# EAGLE design ServoShield (EAGLE 5.11)
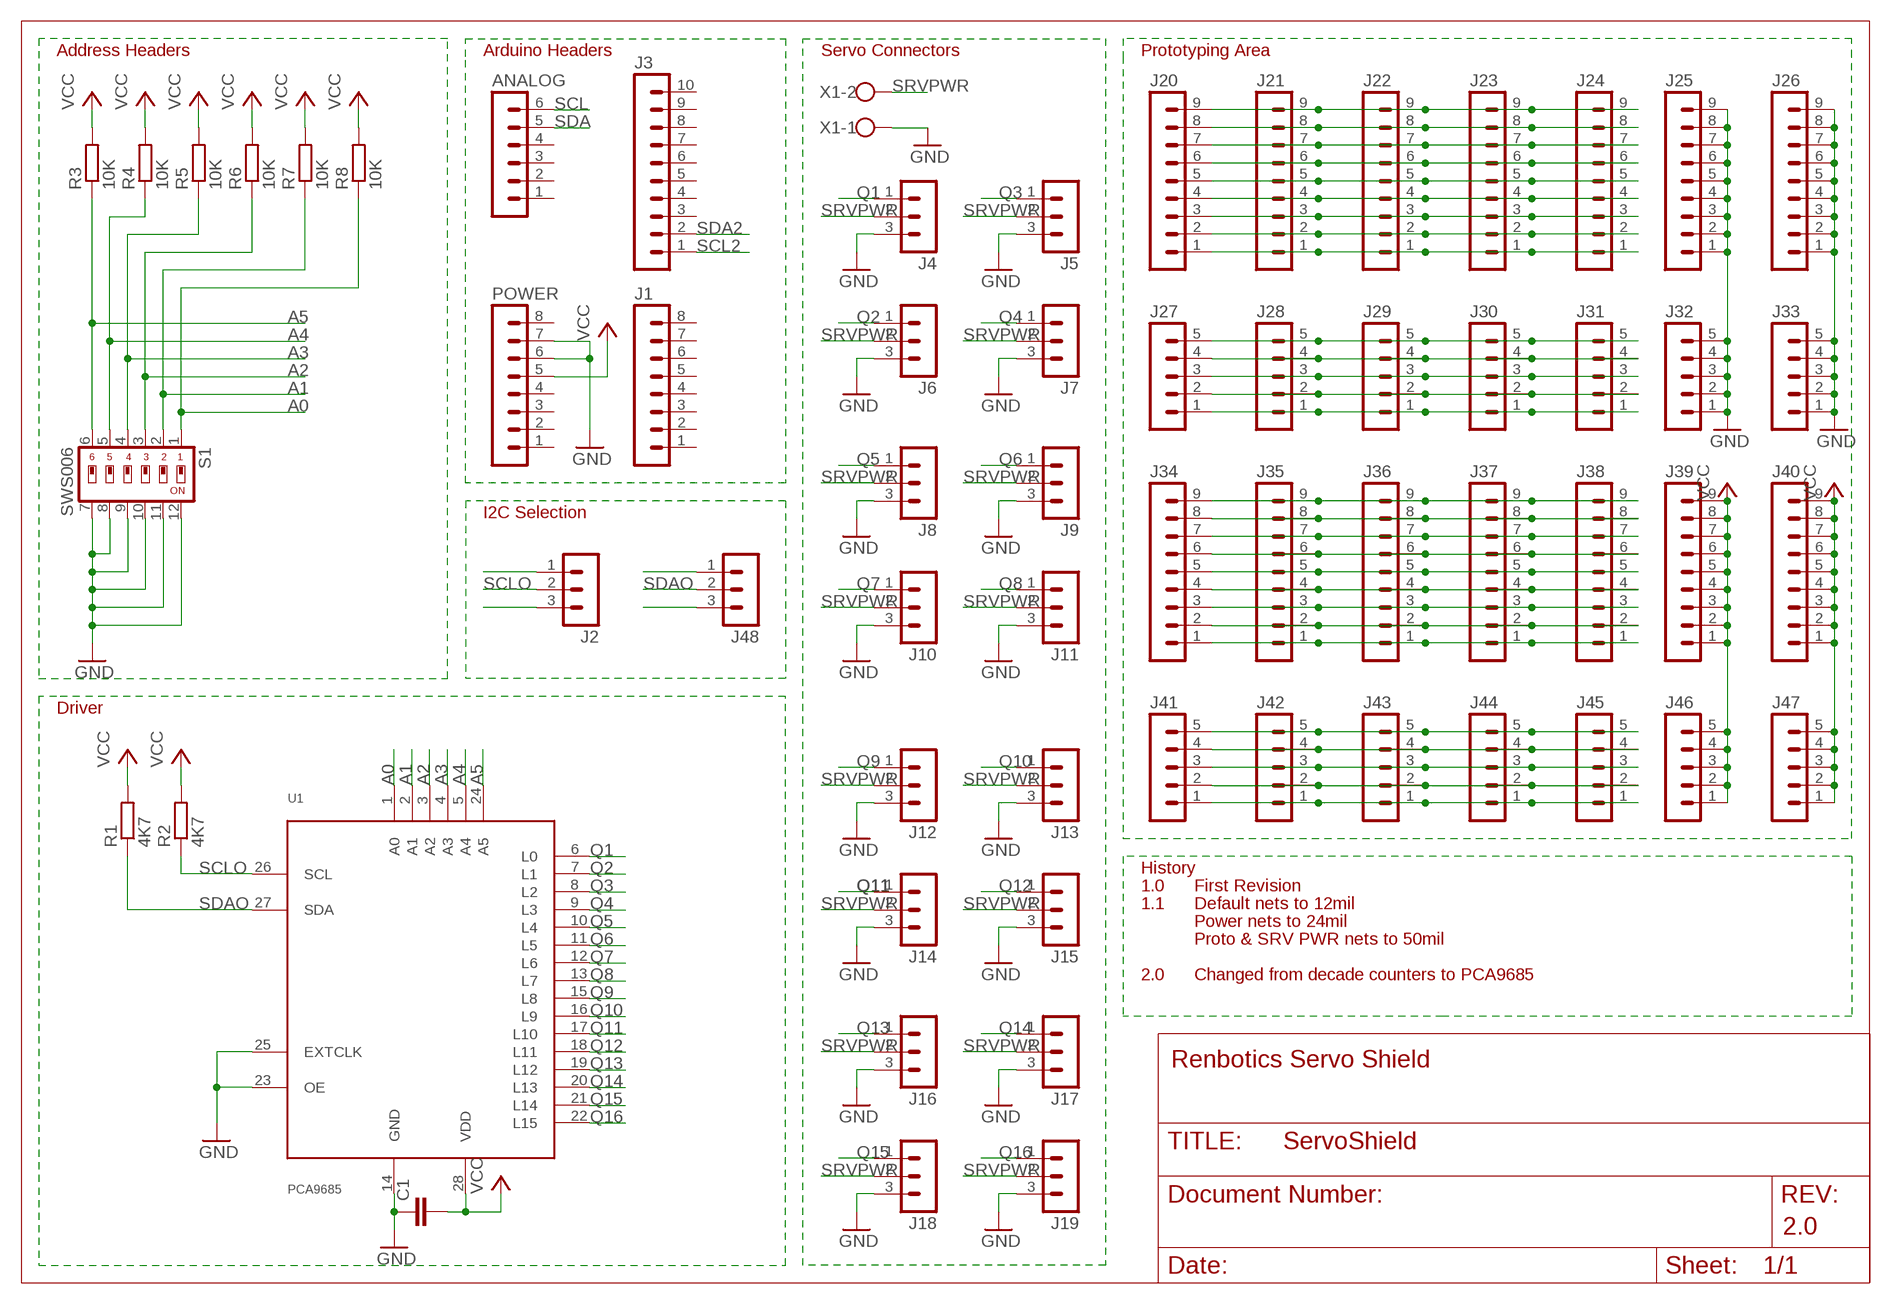
[diagram p0: schematic, sheet 1]

## Parts
ANALOG  MA06-1  [MA06-1]
C1  C-EUC0805  [C0805]
J1  MA08-1  [MA08-1]
J2  MA03-1  [MA03-1]
J3  MA10-1  [MA10-1]
J4  MA03-1  [MA03-1]
J5  MA03-1  [MA03-1]
J6  MA03-1  [MA03-1]
J7  MA03-1  [MA03-1]
J8  MA03-1  [MA03-1]
J9  MA03-1  [MA03-1]
J10  MA03-1  [MA03-1]
J11  MA03-1  [MA03-1]
J12  MA03-1  [MA03-1]
J13  MA03-1  [MA03-1]
J14  MA03-1  [MA03-1]
J15  MA03-1  [MA03-1]
J16  MA03-1  [MA03-1]
J17  MA03-1  [MA03-1]
J18  MA03-1  [MA03-1]
J19  MA03-1  [MA03-1]
J20  MA09-1  [MA09-1]
J21  MA09-1  [MA09-1]
J22  MA09-1  [MA09-1]
J23  MA09-1  [MA09-1]
J24  MA09-1  [MA09-1]
J25  MA09-1  [MA09-1]
J26  MA09-1  [MA09-1]
J27  MA05-1  [MA05-1]
J28  MA05-1  [MA05-1]
J29  MA05-1  [MA05-1]
J30  MA05-1  [MA05-1]
J31  MA05-1  [MA05-1]
J32  MA05-1  [MA05-1]
J33  MA05-1  [MA05-1]
J34  MA09-1  [MA09-1]
J35  MA09-1  [MA09-1]
J36  MA09-1  [MA09-1]
J37  MA09-1  [MA09-1]
J38  MA09-1  [MA09-1]
J39  MA09-1  [MA09-1]
J40  MA09-1  [MA09-1]
J41  MA05-1  [MA05-1]
J42  MA05-1  [MA05-1]
J43  MA05-1  [MA05-1]
J44  MA05-1  [MA05-1]
J45  MA05-1  [MA05-1]
J46  MA05-1  [MA05-1]
J47  MA05-1  [MA05-1]
J48  MA03-1  [MA03-1]
POWER  MA08-1  [MA08-1]
R1  4K7  R-EU_R0805  [R0805]
R2  4K7  R-EU_R0805  [R0805]
R3  10K  R-EU_R0805  [R0805]
R4  10K  R-EU_R0805  [R0805]
R5  10K  R-EU_R0805  [R0805]
R6  10K  R-EU_R0805  [R0805]
R7  10K  R-EU_R0805  [R0805]
R8  10K  R-EU_R0805  [R0805]
S1  SWS006  [SMS-006]
U1  PCA9685  [TSSOP28]
X1  W237-102  [W237-102]

## Nets
A0: R8.1 S1.1 U1.1(A0)
A1: R7.1 S1.2 U1.2(A1)
A2: R6.1 S1.3 U1.3(A2)
A3: R5.1 S1.4 U1.4(A3)
A4: R4.1 S1.5 U1.5(A4)
A5: R3.1 S1.6 U1.24(A5)
GND: C1.1 J4.3 J5.3 J6.3 J7.3 J8.3 J9.3 J10.3 J11.3 J12.3 J13.3 J14.3 J15.3 J16.3 J17.3 J18.3 J19.3 J25.1 J25.2 J25.3 J25.4 J25.5 J25.6 J25.7 J25.8 J25.9 J26.1 J26.2 J26.3 J26.4 J26.5 J26.6 J26.7 J26.8 J26.9 J32.1 J32.2 J32.3 J32.4 J32.5 J33.1 J33.2 J33.3 J33.4 J33.5 POWER.6 POWER.7 S1.7 S1.8 S1.9 S1.10 S1.11 S1.12 U1.14(GND) U1.23(OE) U1.25(EXTCLK) X1.1
N$1: J20.1 J21.1 J22.1 J23.1 J24.1
N$2: J20.2 J21.2 J22.2 J23.2 J24.2
N$3: J20.3 J21.3 J22.3 J23.3 J24.3
N$4: J20.4 J21.4 J22.4 J23.4 J24.4
N$5: J20.5 J21.5 J22.5 J23.5 J24.5
N$6: J20.6 J21.6 J22.6 J23.6 J24.6
N$7: J20.7 J21.7 J22.7 J23.7 J24.7
N$8: J20.8 J21.8 J22.8 J23.8 J24.8
N$9: J20.9 J21.9 J22.9 J23.9 J24.9
N$10: J27.5 J28.5 J29.5 J30.5 J31.5
N$11: J27.4 J28.4 J29.4 J30.4 J31.4
N$12: J27.3 J28.3 J29.3 J30.3 J31.3
N$13: J27.2 J28.2 J29.2 J30.2 J31.2
N$14: J27.1 J28.1 J29.1 J30.1 J31.1
N$19: J34.9 J35.9 J36.9 J37.9 J38.9
N$20: J34.8 J35.8 J36.8 J37.8 J38.8
N$21: J34.7 J35.7 J36.7 J37.7 J38.7
N$22: J34.6 J35.6 J36.6 J37.6 J38.6
N$23: J34.5 J35.5 J36.5 J37.5 J38.5
N$24: J34.4 J35.4 J36.4 J37.4 J38.4
N$25: J34.3 J35.3 J36.3 J37.3 J38.3
N$26: J34.2 J35.2 J36.2 J37.2 J38.2
N$27: J34.1 J35.1 J36.1 J37.1 J38.1
N$28: J41.5 J42.5 J43.5 J44.5 J45.5
N$29: J41.4 J42.4 J43.4 J44.4 J45.4
N$30: J41.3 J42.3 J43.3 J44.3 J45.3
N$31: J41.2 J42.2 J43.2 J44.2 J45.2
N$32: J41.1 J42.1 J43.1 J44.1 J45.1
Q1: J4.1 U1.6(L0)
Q2: J6.1 U1.7(L1)
Q3: J5.1 U1.8(L2)
Q4: J7.1 U1.9(L3)
Q5: J8.1 U1.10(L4)
Q6: J9.1 U1.11(L5)
Q7: J10.1 U1.12(L6)
Q8: J11.1 U1.13(L7)
Q9: J12.1 U1.15(L8)
Q10: J13.1 U1.16(L9)
Q11: J14.1 U1.17(L10)
Q12: J15.1 U1.18(L11)
Q13: J16.1 U1.19(L12)
Q14: J17.1 U1.20(L13)
Q15: J18.1 U1.21(L14)
Q16: J19.1 U1.22(L15)
SCL: ANALOG.6 J2.3
SCL2: J2.1 J3.1
SCLO: J2.2 R2.1 U1.26(SCL)
SDA: ANALOG.5 J48.3
SDA2: J3.2 J48.1
SDAO: J48.2 R1.1 U1.27(SDA)
SRVPWR: J4.2 J5.2 J6.2 J7.2 J8.2 J9.2 J10.2 J11.2 J12.2 J13.2 J14.2 J15.2 J16.2 J17.2 J18.2 J19.2 X1.2
VCC: C1.2 J39.1 J39.2 J39.3 J39.4 J39.5 J39.6 J39.7 J39.8 J39.9 J40.1 J40.2 J40.3 J40.4 J40.5 J40.6 J40.7 J40.8 J40.9 J46.1 J46.2 J46.3 J46.4 J46.5 J47.1 J47.2 J47.3 J47.4 J47.5 POWER.5 R1.2 R2.2 R3.2 R4.2 R5.2 R6.2 R7.2 R8.2 U1.28(VDD)
Unconnected: ANALOG.1 ANALOG.2 ANALOG.3 ANALOG.4 J1.1 J1.2 J1.3 J1.4 J1.5 J1.6 J1.7 J1.8 J3.3 J3.4 J3.5 J3.6 J3.7 J3.8 J3.9 J3.10 POWER.1 POWER.2 POWER.3 POWER.4 POWER.8

## Notes on the sheet
- Address Headers | Arduino Headers | Servo Connectors | Prototyping Area
- I2C Selection
- Driver
- History
- 1.0 | First Revision
- 1.1 | Default nets to 12mil
- Power nets to 24mil
- Proto & SRV PWR nets to 50mil
- 2.0 | Changed from decade counters to PCA9685
- Renbotics Servo Shield
- 2.0

## Library data of the parts
ANALOG = con-lstb:MA06-1: PIN HEADER
C1 = resistor:C-EU: CAPACITOR, European symbol
J1 POWER = con-lstbupdate:MA08-1: PIN HEADER; OC_FARNELL: unknown; OC_NEWARK: unknown
J2 J4-J19 J48 = con-lstb:MA03-1: PIN HEADER
J3 = con-lstbupdate:MA10-1: PIN HEADER; OC_FARNELL: unknown; OC_NEWARK: unknown
J20-J26 J34-J40 = con-lstb:MA09-1: PIN HEADER
J27-J33 J41-J47 = con-lstb:MA05-1: PIN HEADER
R1-R8 = resistor:R-EU_: RESISTOR, European symbol
S1 = smd-special:SWS006: SMD Dip Switch 6 pol.
U1 = wsmith:PCA9685
X1 = con-wago-500:W237-102: WAGO SCREW CLAMP

## Net classes
0 default: width 0.254 mm, drill 0.305 mm, clearance 0.152 mm
1 power: width 0.61 mm, drill 0.508 mm, clearance 0.152 mm

## Board
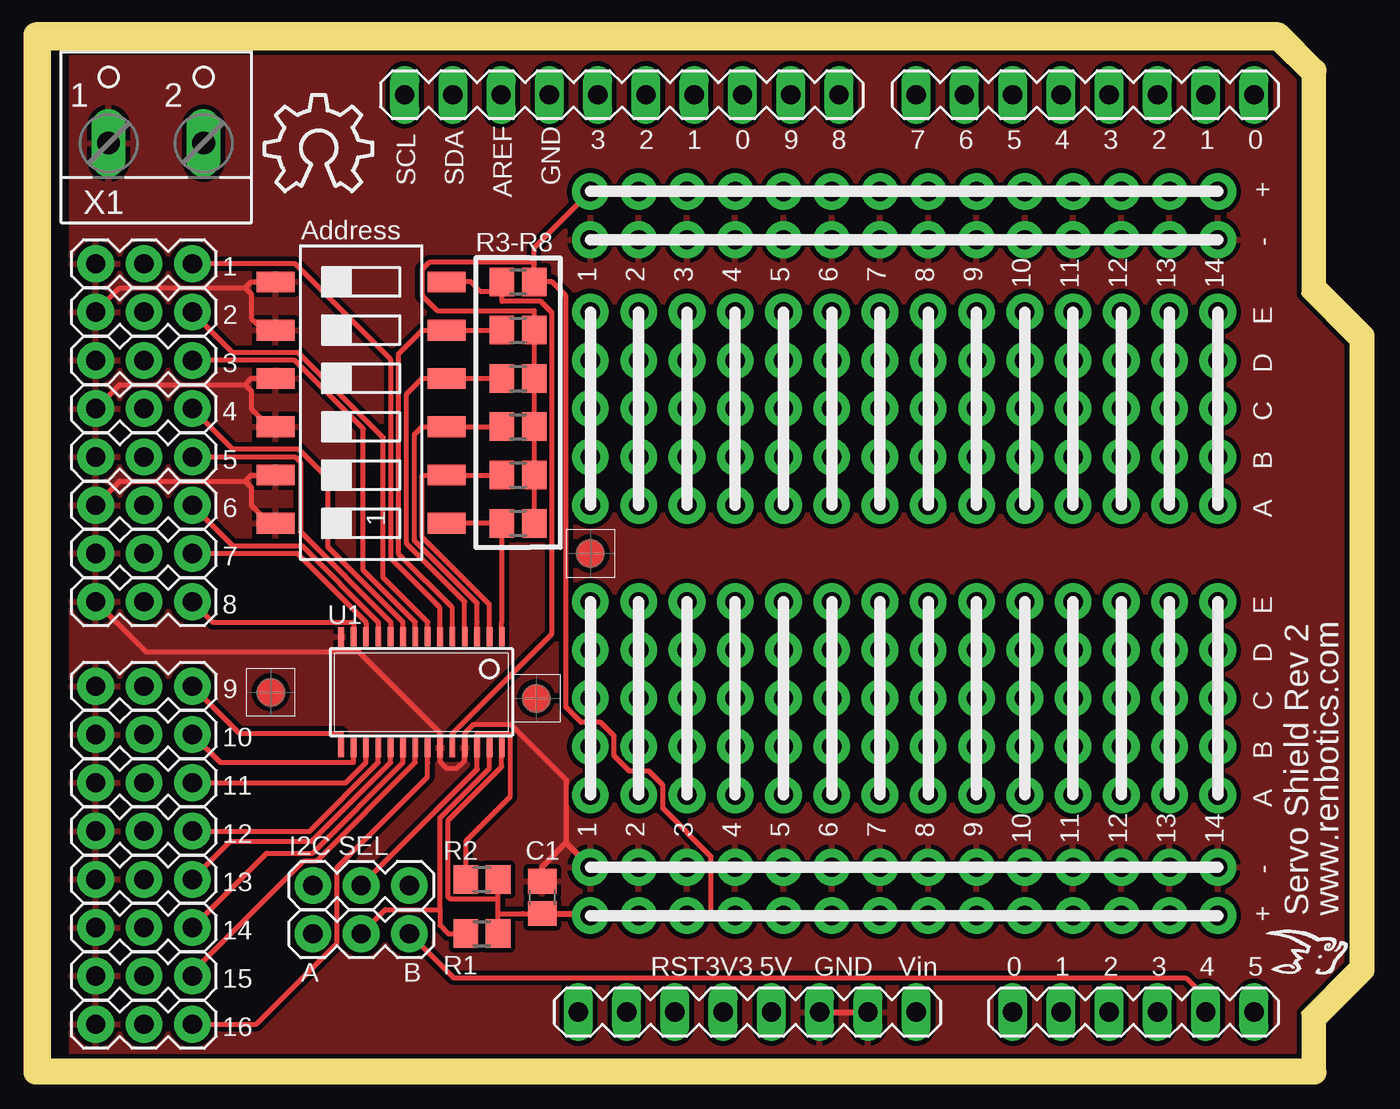
[diagram p1: board, top side]
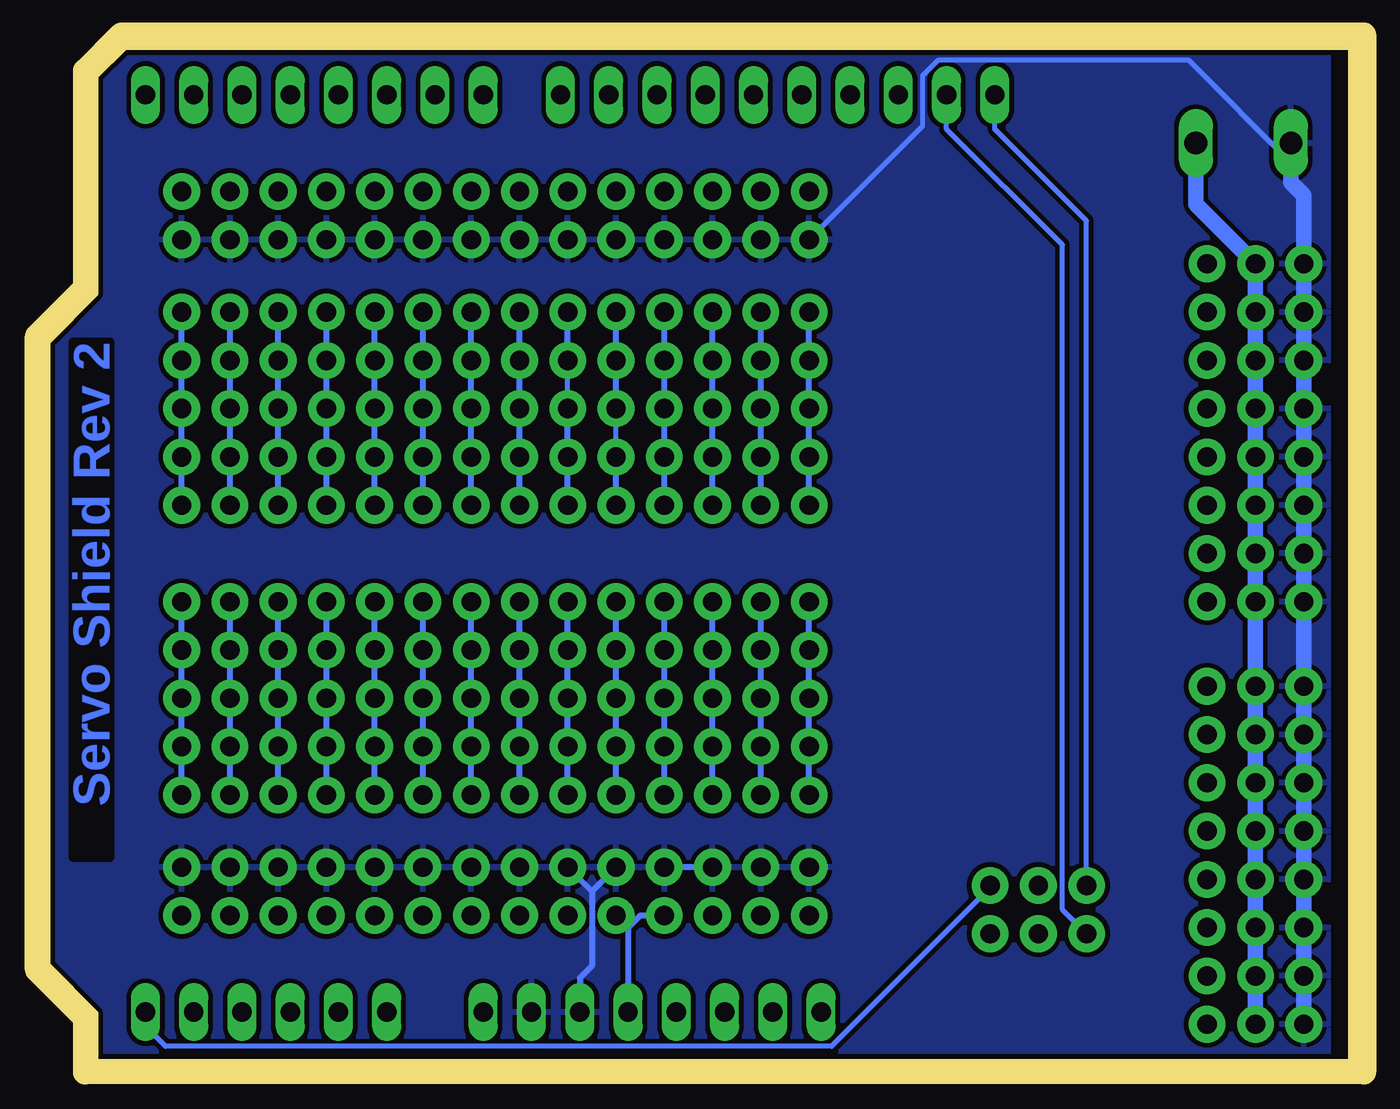
[diagram p2: board, bottom side, seen from below]

Size 68.66 x 53.34 mm. Coordinates in mm from the lower left corner, seen from the top.
Outline: 0,47.03 0,0.05
Outline: 0.08,53.34 64.59,53.34 66.12,51.82 66.12,40.39 68.66,37.85 68.66,5.08 66.12,2.54 66.12,0 0.08,0 0.08,53.34
Copper layers (1*16): Top 0.035mm / dielectric 1.5mm / Bottom 0.035mm
Design rules "Fusion_eagle_rule_v1.1": minimum track width 6mil, minimum drill 12mil, track to track 6mil, track to pad 6mil, pad to pad 6mil, via to via 6mil, smd to smd 0mil, copper to edge 10mil, drill to drill 10mil, minimum pad ring 10mil, minimum via ring 6mil, stop-mask expansion 2mil, vias tented up to drill 100mil, thermal gap 10mil
Milling: 9 lines

### Footprints (pad centres in the part's own frame; a part is rotated, then mirrored left to right if it is on the bottom)
MA06-1 = drill 1.016 long: 1 -6.35,0; 2 -3.81,0; 3 -1.27,0; 4 1.27,0; 5 3.81,0; 6 6.35,0
C0805 = smd 1.3 x 1.5: 1 -0.85,0; 2 0.85,0
MA08-1 = drill 1.016 long: 1 -8.89,0; 2 -6.35,0; 3 -3.81,0; 4 -1.27,0; 5 1.27,0; 6 3.81,0; 7 6.35,0; 8 8.89,0
MA03-1 = drill 1.016 pad 1.93 round: 1 -2.54,0; 2 0,0; 3 2.54,0
MA10-1 = drill 1.016 long: 1 -11.43,0; 2 -8.89,0; 3 -6.35,0; 4 -3.81,0; 5 -1.27,0; 6 1.27,0; 7 3.81,0; 8 6.35,0; 9 8.89,0; 10 11.43,0
MA09-1 = drill 1.016 pad 1.93 round: 1 -10.16,0; 2 -7.62,0; 3 -5.08,0; 4 -2.54,0; 5 0,0; 6 2.54,0; 7 5.08,0; 8 7.62,0; 9 10.16,0
MA05-1 = drill 1.016 pad 1.93 round: 1 -5.08,0; 2 -2.54,0; 3 0,0; 4 2.54,0; 5 5.08,0
R0805 = smd 1.3 x 1.5: 1 -0.85,0; 2 0.85,0
SMS-006 = smd 1.092 x 2.007: 1 -6.35,-4.496; 2 -3.81,-4.496; 3 -1.27,-4.496; 4 1.27,-4.496; 5 3.81,-4.496; 6 6.35,-4.496; 7 6.35,4.496; 8 3.81,4.496; 9 1.27,4.496; 10 -1.27,4.496; 11 -3.81,4.496; 12 -6.35,4.496
TSSOP28 = smd 0.305 x 0.991: 1 -4.225,-2.918; 2 -3.575,-2.918; 3 -2.925,-2.918; 4 -2.275,-2.918; 5 -1.625,-2.918; 6 -0.975,-2.918; 7 -0.325,-2.918; 8 0.325,-2.918; 9 0.975,-2.918; 10 1.625,-2.918; 11 2.275,-2.918; 12 2.925,-2.918; 13 3.575,-2.918; 14 4.225,-2.918; 15 4.225,2.918; 16 3.575,2.918; 17 2.925,2.918; 18 2.275,2.918; 19 1.625,2.918; 20 0.975,2.918; 21 0.325,2.918; 22 -0.325,2.918; 23 -0.975,2.918; 24 -1.625,2.918; 25 -2.275,2.918; 26 -2.925,2.918; 27 -3.575,2.918; 28 -4.225,2.918
W237-102 = drill 1.194 long: 1 -2.5,-1.27; 2 2.5,-1.27

### Placement (x,y rotation side)
ANALOG  57.15,2.59 0 top
C1  26.04,8.62 270 top
J1  54.61,50.85 0 top
J2  16.51,9.26 0 top
J3  30.23,50.85 0 top
J4  5.08,41.96 180 top
J5  5.08,36.88 180 top
J6  5.08,39.42 180 top
J7  5.08,34.34 180 top
J8  5.08,31.8 180 top
J9  5.08,29.26 180 top
J10  5.08,26.72 180 top
J11  5.08,24.18 180 top
J12  5.08,19.74 180 top
J13  5.08,17.2 180 top
J14  5.08,14.66 180 top
J15  5.08,12.12 180 top
J16  5.08,9.58 180 top
J17  5.08,7.04 180 top
J18  5.08,4.5 180 top
J19  5.08,1.96 180 top
J20  51.44,39.42 0 top
J21  51.44,36.88 0 top
J22  51.44,34.34 0 top
J23  51.44,31.8 0 top
J24  51.44,29.26 0 top
J25  51.44,43.23 0 top
J26  51.44,10.21 0 top
J27  33.66,39.42 0 top
J28  33.66,36.88 0 top
J29  33.66,34.34 0 top
J30  33.66,31.8 0 top
J31  33.66,29.26 0 top
J32  33.66,43.23 0 top
J33  33.66,10.21 0 top
J34  51.44,24.18 0 top
J35  51.44,21.64 0 top
J36  51.44,19.1 0 top
J37  51.44,16.56 0 top
J38  51.44,14.02 0 top
J39  51.44,45.77 0 top
J40  51.44,7.67 0 top
J41  33.66,21.64 0 top
J42  33.66,24.18 0 top
J43  33.66,19.1 0 top
J44  33.66,16.56 0 top
J45  33.66,14.02 0 top
J46  33.66,45.77 0 top
J47  33.66,7.67 0 top
J48  16.51,6.72 0 top
POWER  36.83,2.59 0 top
R1  22.86,6.72 0 top
R2  22.86,9.58 0 top
R3  24.77,41.01 0 top
R4  24.77,38.47 0 top
R5  24.77,35.93 0 top
R6  24.77,33.39 0 top
R7  24.77,30.85 0 top
R8  24.77,28.31 0 top
S1  16.51,34.66 90 top
U1  19.68,19.42 180 top
U$1  [OSHW_8X200_NOTEXT]  11.43,45.77 0 top
U$2  [FIDUCIAL_G15S]  11.75,19.42 0 top
U$3  [FIDUCIAL_G15S]  28.57,26.72 0 top
U$4  [FIDUCIAL_G15S]  25.72,19.1 0 top
X1  5.71,49.58 0 top

### Tracks (layer width: path | path; a pad name or v marks a point on that pad's centre or on a via)
A0
  Top 0.254: S1.1 R8.1 23.91,23.12 23.91,23.11 U1.1
A1
  Top 0.254: U1.2 23.26,23.11 23.26,24.03 19.72,27.57 19.72,30.85 S1.2 R7.1
A2
  Top 0.254: 22.61,23.11 | 22.61,23.11 22.61,24.11 19.32,27.4 19.32,32.98 19.72,33.39 S1.3 R6.1 | U1.3 22.61,23.11
A3
  Top 0.254: U1.4 21.96,24.18 18.91,27.23 18.91,35.12 19.72,35.93 S1.4 R5.1
A4
  Top 0.254: U1.5 21.31,23.86 18.48,26.69 18.48,37.23 19.72,38.47 S1.5 R4.1
A5
  Top 0.254: S1.6 22.29,41.01 22.8,40.49 23.91,40.49 | 23.91,40.49 23.91,39.98 25.95,39.98 26.55,39.39 26.55,22.51 21.31,17.28 U1.24 | 23.91,40.49 R3.1
GND
  Top 0.254: 10.41,40.69 10.73,41.01 S1.7 | 10.41,40.69 3.81,40.69 J6.3 | S1.8 11.37,38.47 10.73,39.11 10.73,40.37 10.41,40.69 | 10.41,35.61 10.73,35.93 S1.9 | 10.41,35.61 3.81,35.61 J7.3 | S1.10 11.68,33.39 10.73,34.33 10.73,35.29 10.41,35.61 | 15.46,21.56 16.37,21.56 20.66,17.28 U1.23 20.66,15.76 21.02,15.41 21.54,15.41 21.96,15.83 U1.25 21.96,17.28 22.42,17.73 24.37,17.73 27.29,14.81 27.29,11.49 | 15.46,21.56 5.16,21.56 4.76,21.96 J11.3 | 10.41,30.53 3.81,30.53 J9.3 | 15.46,21.56 U1.14 | 10.41,30.53 10.73,30.85 S1.11 | S1.12 11.68,28.31 10.73,29.25 10.73,30.21 10.41,30.53
  Top 0.305: POWER.6 POWER.7 | C1.1 26.04,10.24 26.2,10.4 27.29,11.49 J33.1 J33.2 J33.3 | J33.4 J33.5 | J32.1 J32.2 J32.3 J32.4 J32.5 J25.1 J25.2 J25.3 J25.4 J25.5 J25.6 J25.7 J25.8 J25.9 | J26.9 J26.8 J26.7 J26.6 J26.5 J26.4 J26.3 J26.2 J26.1
  Bottom 0.254: 3.21,47.28 8.6,52.66 21.8,52.66 22.61,51.86 22.61,49.2 J32.1
  Bottom 0.305: 40.01,8.94 40.01,5.03 40.64,4.39 POWER.6 | 40.01,8.94 J26.1 | J33.5 40.01,8.94 | J33.3 J33.4
  Bottom 0.813: X1.1 3.21,47.28 3.21,46.24 2.54,45.57 J4.3 J6.3 J5.3 J7.3 J8.3 J9.3 J10.3 J11.3 J12.3 J13.3 J14.3 J15.3 J16.3 J17.3 J18.3 J19.3
  pour Bottom (isolate 0.254): 1.27,53.71 1.27,-0.27 69.22,0.37 69.22,52.44 69.22,53.07 69.22,53.71
  pour Top (isolate 0.254): 1.27,53.71 1.27,-0.27 69.22,0.37 69.22,53.71
N$1
  Bottom 0.254: J22.1 J21.1
  Bottom 0.305: J24.1 J23.1 J22.1 | J21.1 J20.1
N$2
  Bottom 0.305: J24.2 J23.2 J22.2 J21.2 J20.2
N$3
  Bottom 0.305: J24.3 J23.3 J22.3 J21.3 J20.3
N$4
  Bottom 0.305: J24.4 J23.4 J22.4 J21.4 J20.4
N$5
  Bottom 0.305: J24.5 J23.5 J22.5 J21.5 J20.5
N$6
  Bottom 0.305: J24.6 J23.6 J22.6 J21.6 J20.6
N$7
  Bottom 0.305: J24.7 J23.7 J22.7 J21.7 J20.7
N$8
  Bottom 0.305: J24.8 J23.8 J22.8 J21.8 J20.8
N$9
  Bottom 0.305: J24.9 J23.9 J22.9 J21.9 J20.9
N$10
  Bottom 0.254: J30.5 J29.5
  Bottom 0.305: J31.5 J30.5 | J29.5 J28.5 J27.5
N$11
  Bottom 0.305: J31.4 J30.4 J29.4 J28.4 J27.4
N$12
  Bottom 0.305: J31.3 J30.3 J29.3 J28.3 J27.3
N$13
  Bottom 0.305: J31.2 J30.2 J29.2 J28.2 J27.2
N$14
  Bottom 0.305: J31.1 J30.1 J29.1 J28.1 J27.1
N$19
  Bottom 0.305: J38.9 J37.9 J36.9 J35.9 J34.9
N$20
  Bottom 0.305: J38.8 J37.8 J36.8 J35.8 J34.8
N$21
  Bottom 0.305: J38.7 J37.7 J36.7 J35.7 J34.7
N$22
  Bottom 0.305: J38.6 J37.6 J36.6 J35.6 J34.6
N$23
  Bottom 0.305: J38.5 J37.5 J36.5 J35.5 J34.5
N$24
  Bottom 0.305: J38.4 J37.4 J36.4 J35.4 J34.4
N$25
  Bottom 0.305: J38.3 J37.3 J36.3 J35.3 J34.3
N$26
  Bottom 0.305: J38.2 J37.2 J36.2 J35.2 J34.2
N$27
  Bottom 0.305: J38.1 J37.1 J36.1 J35.1 J34.1
N$28
  Bottom 0.305: J45.5 J44.5 J43.5 J41.5 J42.5
N$29
  Bottom 0.305: J45.4 J44.4 J43.4 J41.4 J42.4
N$30
  Bottom 0.305: J45.3 J44.3 J43.3 J41.3 J42.3
N$31
  Bottom 0.305: J45.2 J44.2 J43.2 J41.2 J42.2
N$32
  Bottom 0.305: J42.1 J41.1 J43.1 J44.1 J45.1
Q1
  Top 0.254: U1.6 20.66,23.86 18.08,26.44 18.08,36.9 13.02,41.96 J4.1
Q2
  Top 0.254: U1.7 20.01,23.11 17.67,25.45 17.67,32.81 13.2,37.29 9.75,37.29 J6.1
Q3
  Top 0.254: J5.1 13.01,36.88 16.62,33.27 16.62,25.85 | 16.62,25.85 | 16.62,25.85 19.36,23.11 U1.8
Q4
  Top 0.254: U1.9 18.71,23.11 14.76,27.06 14.76,30.65 13.21,32.21 9.75,32.21 J7.1
Q5
  Top 0.254: U1.10 18.06,23.11 13.32,27.85 13.32,31.51 13.03,31.8 J8.1
Q6
  Top 0.254: U1.11 17.41,23.11 13.39,27.13 9.75,27.13 J9.1
Q7
  Top 0.254: U1.12 16.76,23.11 13.15,26.72 J10.1
Q8
  Top 0.254: U1.13 16.11,23.11 8.69,23.11 J11.1
Q9
  Top 0.254: U1.15 15.46,17.28 10.08,17.28 J12.1
Q10
  Top 0.254: U1.16 16.11,15.73 9.09,15.73 J13.1
Q11
  Top 0.254: U1.17 16.76,15.73 15.69,14.66 J14.1
Q12
  Top 0.254: U1.18 17.41,15.73 13.8,12.12 J15.1
Q13
  Top 0.254: U1.19 18.06,15.73 13.9,11.57 9.61,11.57 J16.1
Q14
  Top 0.254: U1.20 18.71,15.73 13.94,10.96 11.54,10.96 J17.1
Q15
  Top 0.254: U1.21 19.36,15.73 14.19,10.55 13.49,10.55 7.62,4.68 J18.1
Q16
  Top 0.254: U1.22 20.01,15.73 20,14.97 15.24,10.21 15.24,6.2 10.99,1.96 J19.1
SCL
  Bottom 0.254: J2.3 19.05,9.13 27.39,0.79 62.44,0.79 63.5,1.85 ANALOG.6
SCL2
  Bottom 0.254: J2.1 13.97,44.22 18.8,49.05 J3.1
SCLO
  Top 0.254: J2.2 22.61,15.36 U1.26 22.61,17.28 24.23,17.28 24.34,17.16 24.34,13.91 22.01,11.58 R2.1
SDA
  Top 0.254: J48.3 21.37,4.39 59.9,4.39 60.96,3.33 ANALOG.5
SDA2
  Bottom 0.254: J48.1 15.24,7.99 15.24,42.95 21.34,49.05 J3.2
SDAO
  Top 0.254: 20.65,7.99 17.78,7.99 J48.2 | 20.65,7.99 20.65,7.15 21.08,6.72 R1.1 | U1.27 23.26,15.43 20.65,12.82 20.65,7.99
SRVPWR
  Bottom 0.813: J19.2 J18.2 J17.2 J16.2 J15.2 J14.2 J13.2 J12.2 J11.2 J10.2 J9.2 J8.2 J7.2 J5.2 J6.2 J4.2 8.21,45.1 X1.2
VCC
  Top 0.254: 25.61,42.04 25.61,42.81 J46.1 | 25.61,42.04 25.61,41.94 R3.2 26.54,41.01 27.29,40.27 27.29,18.62 28.07,17.83 29.11,17.83 29.82,17.12 29.82,16.07 30.62,15.27 31.65,15.27 32.38,14.53 32.38,13.31 34.92,10.77 34.92,7.67 | 25.61,42.04 20.09,42.04 19.72,41.67 19.72,40.28 20.51,39.5 25.61,39.5 R4.2 R5.2 R6.2 R7.2 R8.2 | 23.71,8.54 R2.2 | 23.71,7.77 23.71,8.54 | U1.28 23.91,15.51 21.08,12.68 21.08,8.65 21.19,8.54 23.71,8.54 | 23.71,7.77 25.01,7.77 C1.2 | 23.71,7.77 23.71,7.75 R1.2 | 28.47,7.77 J47.1
  Top 0.305: C1.2 28.47,7.77 | J47.1 J47.2 J47.3 34.92,7.67 J47.4 | J40.9 J40.8 J40.7 J40.6 J40.5 J40.4 J40.3 J40.2 J40.1 J47.5 | J39.9 J39.8 J39.7 J39.6 J39.5 J39.4 J39.3 J39.2 J39.1 J46.5 J46.4 J46.3 J46.2 J46.1
  Bottom 0.305: 38.1,7.04 POWER.5 | 38.1,7.04 J47.5 | J47.4 37.47,7.67 38.1,7.04

### Text on the board
Bottom: Servo Shield Rev 2
tNames: 3 | 2 | 1 | 0 | 9 | 8 | 7 | 6 | 5 | 4 | 3 | 2 | 1 | 0 | SCL | SDA | AREF | GND | + | Address | R3-R8 | - | 1 | 1 | 2 | 3 | 4 | 5 | 6 | 7 | 8 | 9 | 10 | 11 | 12 | 13 | 14 | 2 | E | 3 | D | 4 | C | 5 | B | 6 | A | 7 | 8 | E | D | 9 | C | 10 | B | 11 | A | 12 | 1 | 2 | 3 | 4 | 5 | 6 | 7 | 8 | 9 | 10 | 11 | 12 | 13 | 14 | I2C SEL | - | 13 | + | Servo Shield Rev 2 | www.renbotics.com | 14 | RST | 3V3 | 5V | GND | Vin | 0 | 1 | 2 | 3 | 4 | 5 | 15 | A | B | 16